# EasyEDA schematic SCH_Satlla_4_Back_side_2023-01-29.json
TITLE: Back_Side; REV: 1.0; Date: 2021-02-23; Sheet: 1/1; Drawn By: kcglaboratory; Company: Your Company
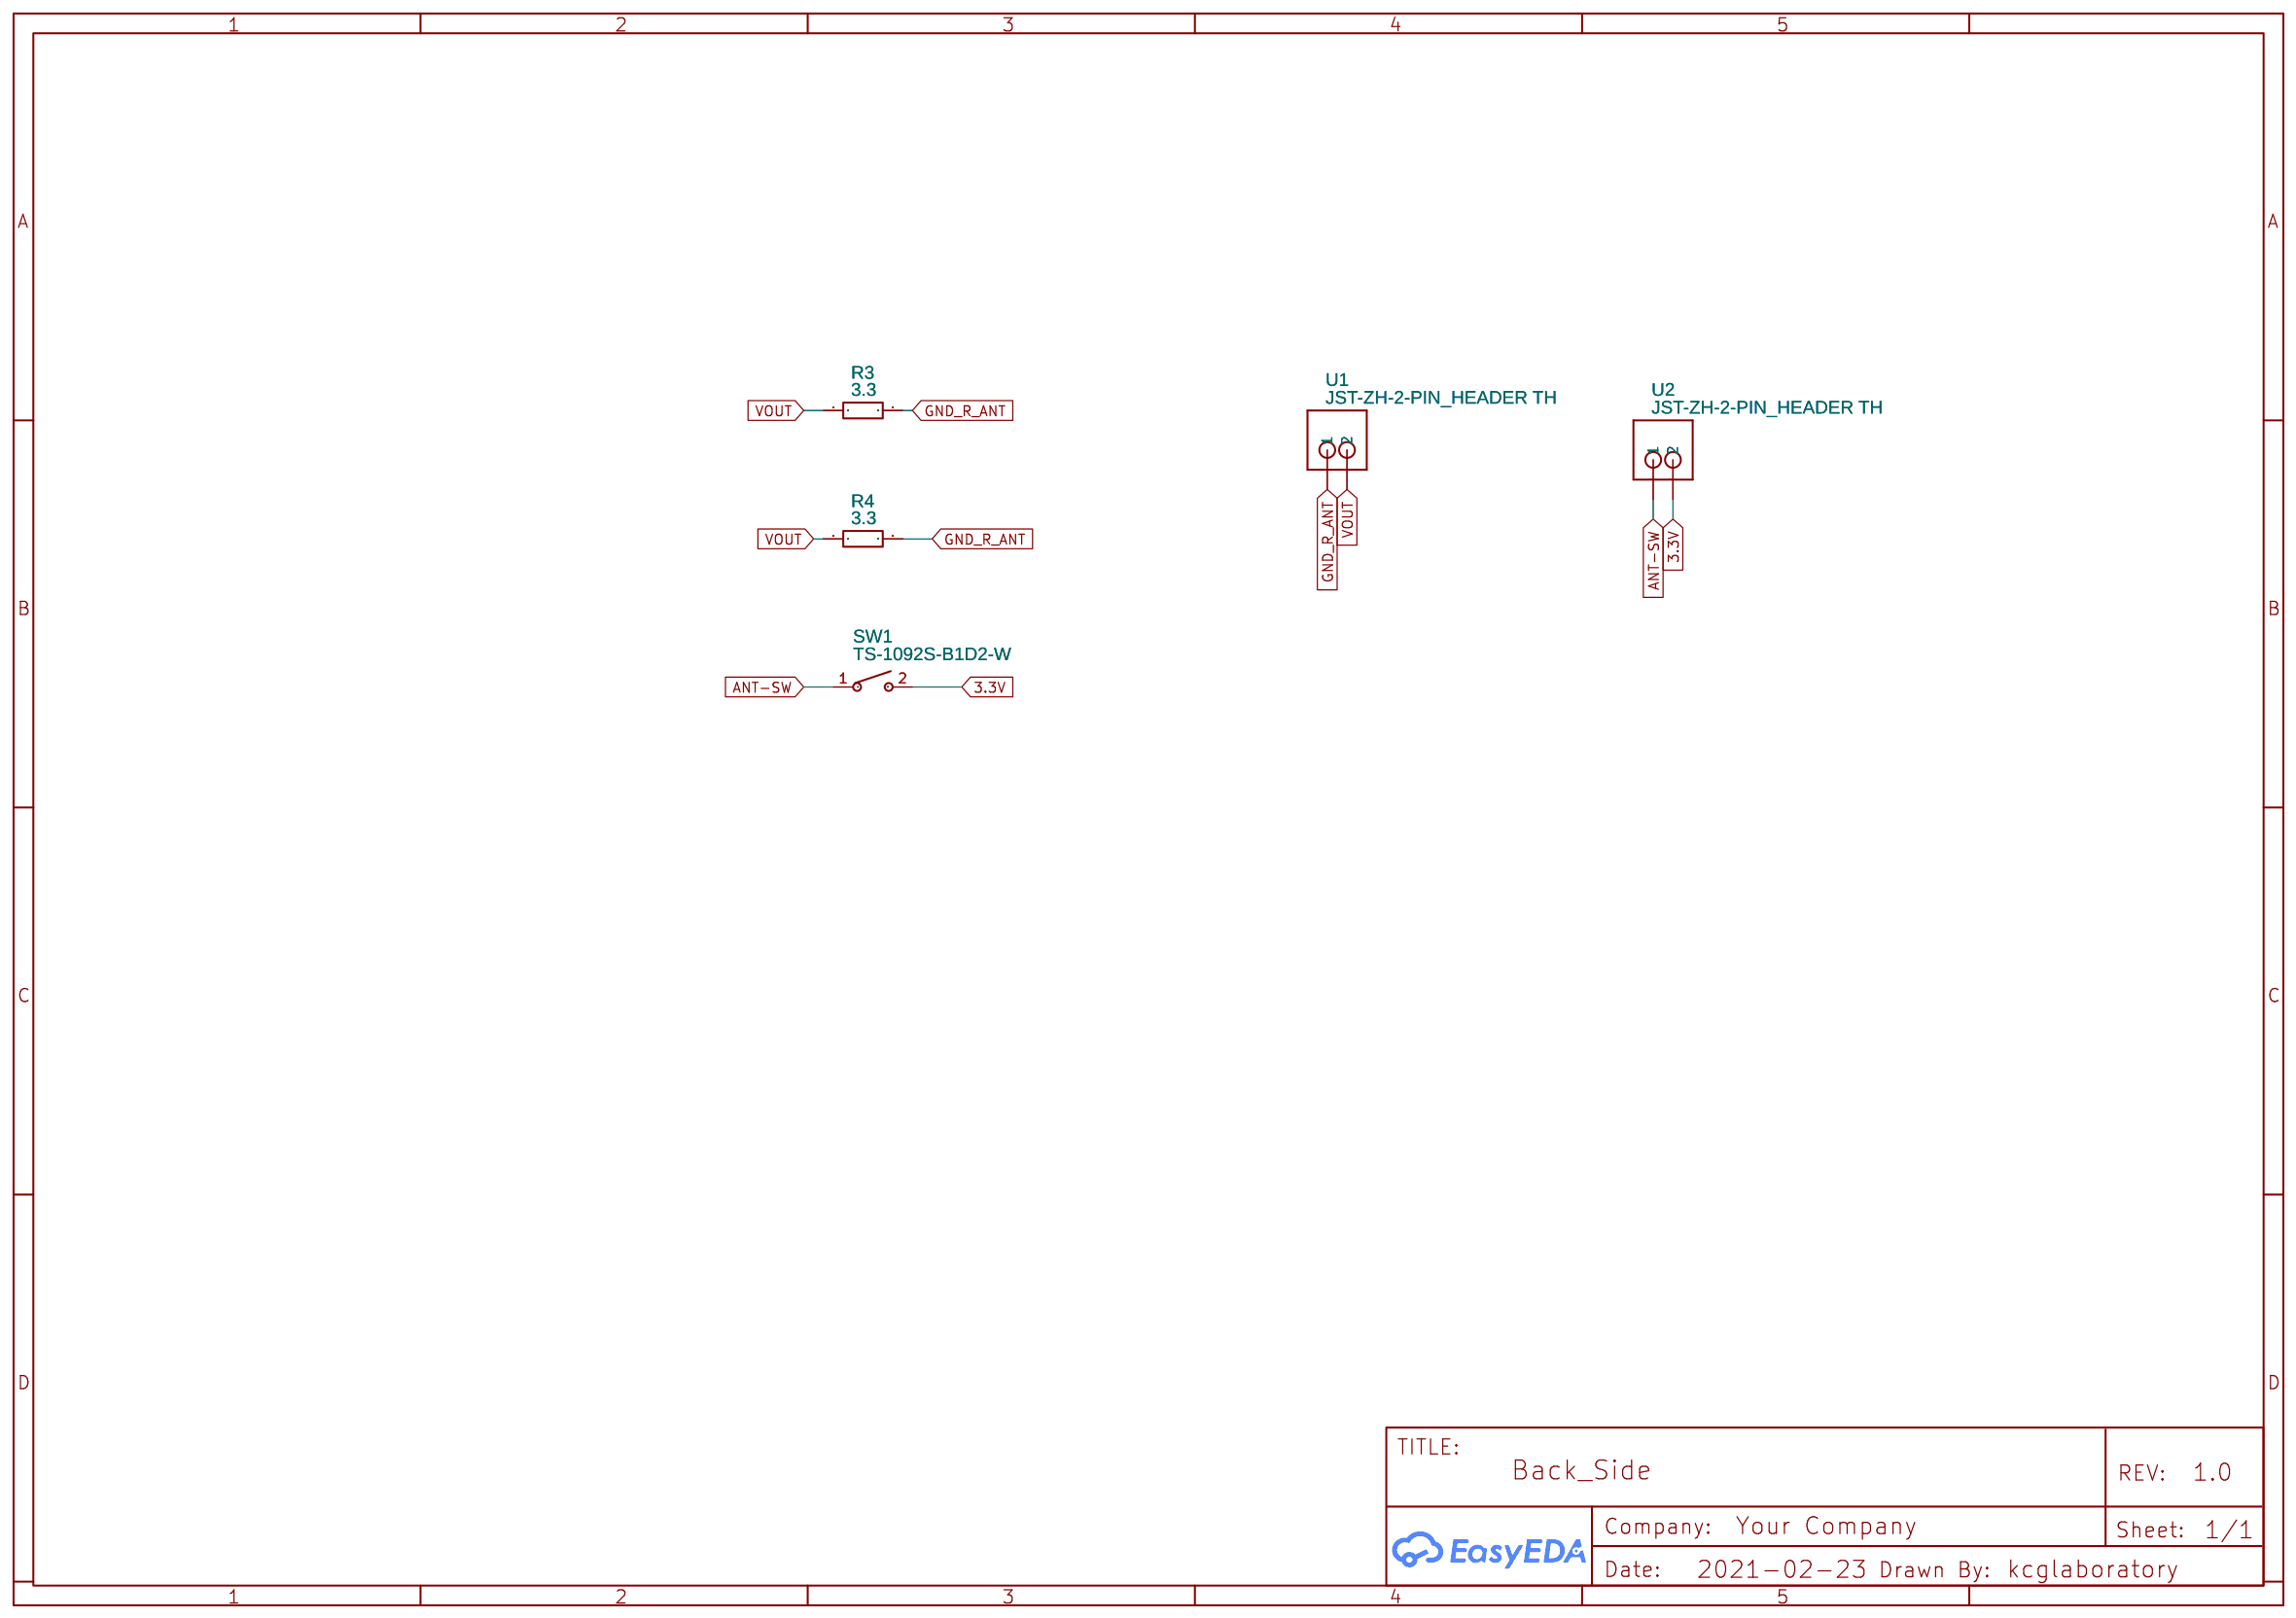
[diagram p0: schematic sheet]

## Parts
R3  3.3  [RES-TH_BD4.0-L10.5-P14.50-D0.6]
R4  3.3  [RES-TH_BD4.0-L10.5-P14.50-D0.6]
SW1  TS-1092S-B1D2-W  [SW-SMD_L6.1-W3.6-LS7.9]
U1  JST-ZH-2-PIN_HEADER TH  [JST-ZH-2 1.5MM TH]
U2  JST-ZH-2-PIN_HEADER TH  [JST-ZH-2 1.5MM TH]

## Library data of the parts
R3 R4 = RD50T53R3J: Supplier: LCSC; Supplier Part: C167570; Manufacturer: TA-I Tech; Contributor: LCSC; JLCPCB Part Class: Extended Part; Resistance: 3.3Ω
SW1 = TS-1092S-B1D2-W: Supplier: LCSC; Supplier Part: C782859; Manufacturer: Yuandi(台湾元迪); Contributor: LCSC; JLCPCB Part Class: Extended Part
U1 U2 = JST-ZH-2-PIN_HEADER TH: Contributor: Herve Goncalves

## Nets
3.3V: SW1.2 U2.2
GND_R_ANT: R3.2 R4.2 U1.1
ANT-SW: SW1.1 U2.1
VOUT: R3.1 R4.1 U1.2
